# EAGLE design door-lock-pcb (EAGLE 9.6.2)
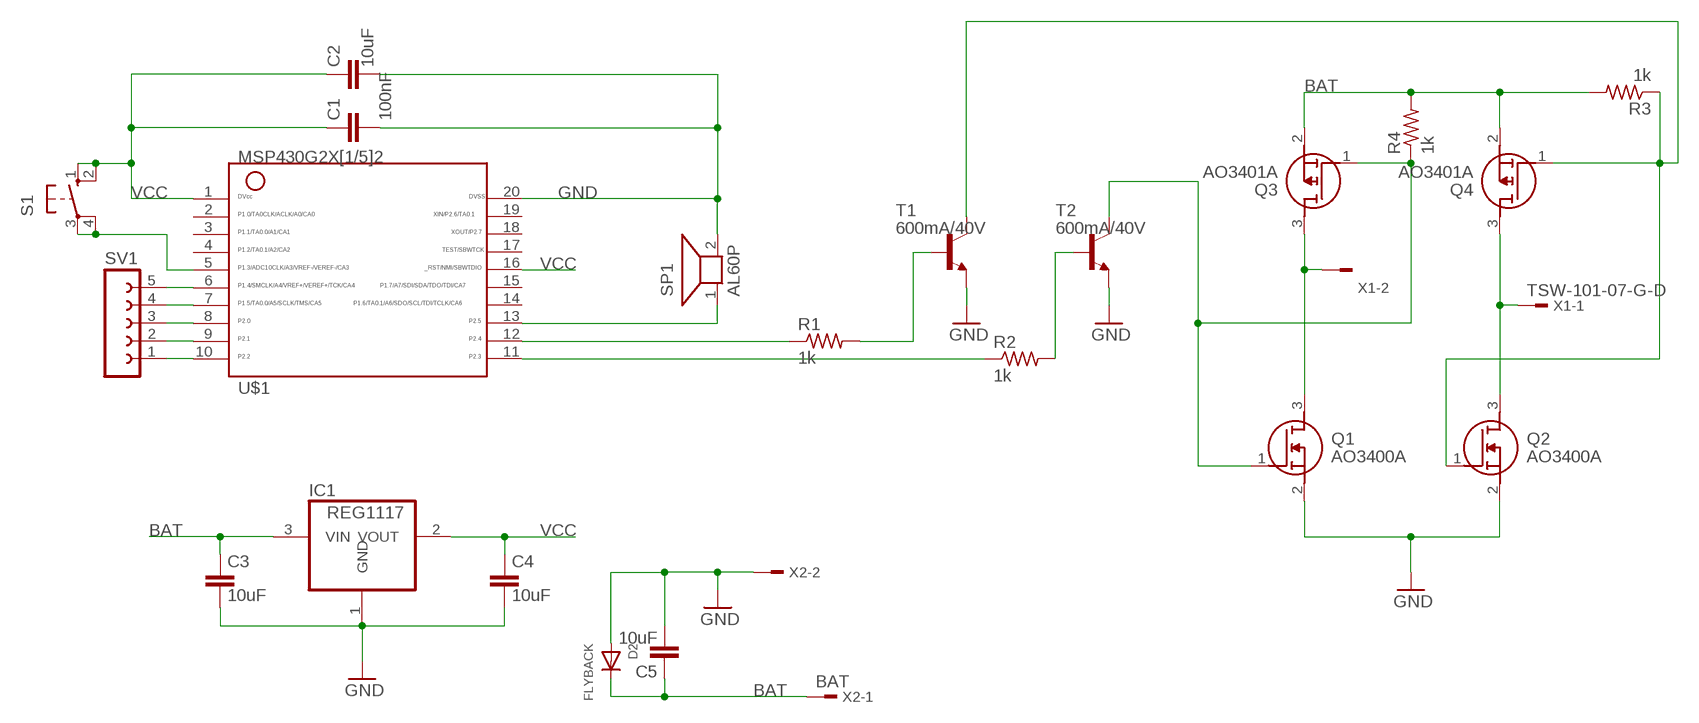
[diagram p0: schematic, sheet 1]

## Parts
C1  100nF  CC0805KRX7R9BB104  [CAP_0805]
C2  10uF  CC0805KRX7R9BB104  [CAP_0805]
C3  10uF  CC0805KRX7R9BB104  [CAP_0805]
C4  10uF  CC0805KRX7R9BB104  [CAP_0805]
C5  10uF  CC0805KRX7R9BB104  [CAP_0805]
D2  FLYBACK  DIODESOD-523  [SOD-523]
IC1  REG1117  [SOT223]
Q1  AO3400A  [SOT95P280X125-3N]
Q2  AO3400A  [SOT95P280X125-3N]
Q3  AO3401A  [SOT95P280X125-3N]
Q4  AO3401A  [SOT95P280X125-3N]
R1  1k  CRCW08050000Z0EA  [RES_0805]
R2  1k  CRCW08050000Z0EA  [RES_0805]
R3  1k  CRCW08050000Z0EA  [RES_0805]
R4  1k  CRCW08050000Z0EA  [RES_0805]
S1  10-XX  [B3F-10XX]
SP1  AL60P  [AL60P]
SV1  FE05-1  [FE05-1]
T1  600mA/40V  TRANS_NPN-MMBT2222AL  [SOT23-3]
T2  600mA/40V  TRANS_NPN-MMBT2222AL  [SOT23-3]
U$1  G2X[1/5]2---N20  [N20]
X1  TSW-101-07-G-D  [TSW-101-XX-G-D]
X2  BAT  TSW-101-07-G-D  [TSW-101-XX-G-D]

## Nets
BAT: C3.1 C5.1 D2.K(C) IC1.3(VIN) Q3.2(S) Q4.2(S) R3.2 R4.2 X2.1
GND: C1.2 C2.2 C3.2 C4.2 C5.2 D2.A IC1.1(GND) Q1.2(S) Q2.2(S) SP1.2 T1.2(E) T2.2(E) U$1.20 X2.2
N$1: SV1.1 U$1.10
N$2: SV1.2 U$1.9
N$3: SV1.3 U$1.8
N$4: SV1.4 U$1.7
N$5: SV1.5 U$1.6
N$6: SP1.1 U$1.13
N$8: S1.3(P) S1.4(P1) U$1.5
N$9: Q1.1(G) Q3.1(G) R4.1 T2.3(C)
N$10: Q2.1(G) Q4.1(G) R3.1 T1.3(C)
N$11: R1.1 U$1.12
N$12: R1.2 T1.1(B)
N$13: R2.2 T2.1(B)
N$14: R2.1 U$1.11
N$18: Q1.3(D) Q3.3(D) X1.2
N$19: Q2.3(D) Q4.3(D) X1.1
VCC: C1.1 C2.1 C4.1 IC1.2(VOUT) S1.1(S) S1.2(S1) U$1.1 U$1.16
Unconnected: U$1.2 U$1.3 U$1.4 U$1.14 U$1.15 U$1.17 U$1.18 U$1.19

## Library data of the parts
C1-C5 = Resistor_Capacitor:CC0805KRX7R9BB104: CAP CER 0.1UF 50V X7R 0805 Manufacturer's datasheet <http://www.yageo.com/documents/recent/UPY-GPHC_X7R_6.3V-to-50V_18.pdf>; CREATED_BY: PCBLayout.com; DIGIKEY_PART_NUMBER: 311-1140-2-ND; MANUFACTURER: Yageo; MPN: CC0805KRX7R9BB104; PACKAGE: SMD 0805
D2 = adafruit:DIODE: Diode SMADIODE - SMA Surface Mount Package 20V 1A Schottky Diode Digikey: 641-1014-6-ND DO-1N4148 - Through Hole Small Current Diode SOD-123 20V 1 A (.5mV Vf) Schottky Diode - Digikey: MBRX120TPMSCT-ND SOD-323 10V 570mA (.38mV Vf, 3ns) Schottky Diode - Digikey: ZLLS410CT-ND SOD-523 30V 30mA Schottky Diode (RB751S-40TE61) - Digikey: RB751S-40TE61CT-ND SOT23-R/W - SOT23 Package (R = Solder Paste/Reflow Ovens, W = Hand-Soldering) BAT54Film 40V 300mA - Digikey: 497-7162-1-ND
IC1 = burr-brown:REG1117: 800mA and 1A Low Dropout (LDO) Positive Regulator 1.8V, 2.5V, 2.85V, 3.3V, 5V, and Adj; MPN: REG1117; OC_FARNELL: 1097566; OC_NEWARK: 14P6981
Q1 Q2 = AO3400A:AO3400A: 30V N-Channel MOSFET Source: Datasheet <http://aosmd.com/res/data_sheets/AO3400A.pdf>; ARROW_PART_NUMBER: AO3400A; ARROW_PRICE-STOCK: https://www.arrow.com/en/products/ao3400a/alpha-and-omega-semiconductor?region=nac; DESCRIPTION: 30V N-Channel MOSFET; HEIGHT: 1.25mm; MANUFACTURER_NAME: Alpha & Omega Semiconductors; MANUFACTURER_PART_NUMBER: AO3400A
Q3 Q4 = AO3401A:AO3401A: 30V P-Channel MOSFET Source: Datasheet <http://www.aosmd.com/pdfs/datasheet/AO3401A.pdf>; ARROW_PART_NUMBER: AO3401A; ARROW_PRICE-STOCK: https://www.arrow.com/en/products/ao3401a/alpha-and-omega-semiconductor?region=nac; DESCRIPTION: 30V P-Channel MOSFET; HEIGHT: 1.25mm; MANUFACTURER_NAME: Alpha & Omega Semiconductors; MANUFACTURER_PART_NUMBER: AO3401A
R1-R4 = Resistor_Capacitor:CRCW08050000Z0EA: RES SMD 0 OHM JUMPER 1/8W 0805 Manufacturer's datasheet <http://www.vishay.com/docs/20035/dcrcwe3.pdf>; CREATED_BY: PCBLayout.com; DIGIKEY_PART_NUMBER: 541-0.0ATR-ND; MANUFACTURER: Vishay Dale; MPN: CRCW08050000Z0EA; PACKAGE: SMD 0805
S1 = switch-omron:10-XX: OMRON SWITCH; MPN: B3F-1000; OC_FARNELL: 176432; OC_NEWARK: 36M3542
SP1 = buzzer:AL60P: SPEAKER Source: Buerklin; OC_FARNELL: unknown; OC_NEWARK: unknown
SV1 = con-lsta:FE05-1: FEMALE HEADER; OC_FARNELL: unknown; OC_NEWARK: unknown
T1 T2 = SparkFun-DiscreteSemi:TRANS_NPN: NPN transistor Current controlled devices typically used to amplify current or used as a switch. BC547 - COM-08928 <http://www.sparkfun.com/products/8928> (TO-92 45V 100mA) (1.Collector 2.Base 3.Emitter) 2N3904 - COM-00521 <http://www.sparkfun.com/products/521> (TO-92 40V 200mA) (1.Emitter 2.Base 3.Collector) P2N2222A - COM-12852 <http://www.sparkfun.com/products/12852> (TO-92 40V 600mA) (1.Collector 2.Base 3.Emitter); PROD_ID: TRANS-08049
U$1 = TI_MSP430_v16:G2X[1/5]2---N20: MSP430G2X[1/5]2 MSP430G2x52, MSP430G2x12 PDIP (N) 20 Pin Package http://focus.ti.com/docs/prod/folders/print/msp430g2452.html
X1 X2 = con-samtec:TSW-101-*-G: THROUGH-HOLE .025" SQ POST HEADER Source: Samtec TSW.pdf; MF: Samtec Inc.; MPN: TSW-101-07-G-D

## Board
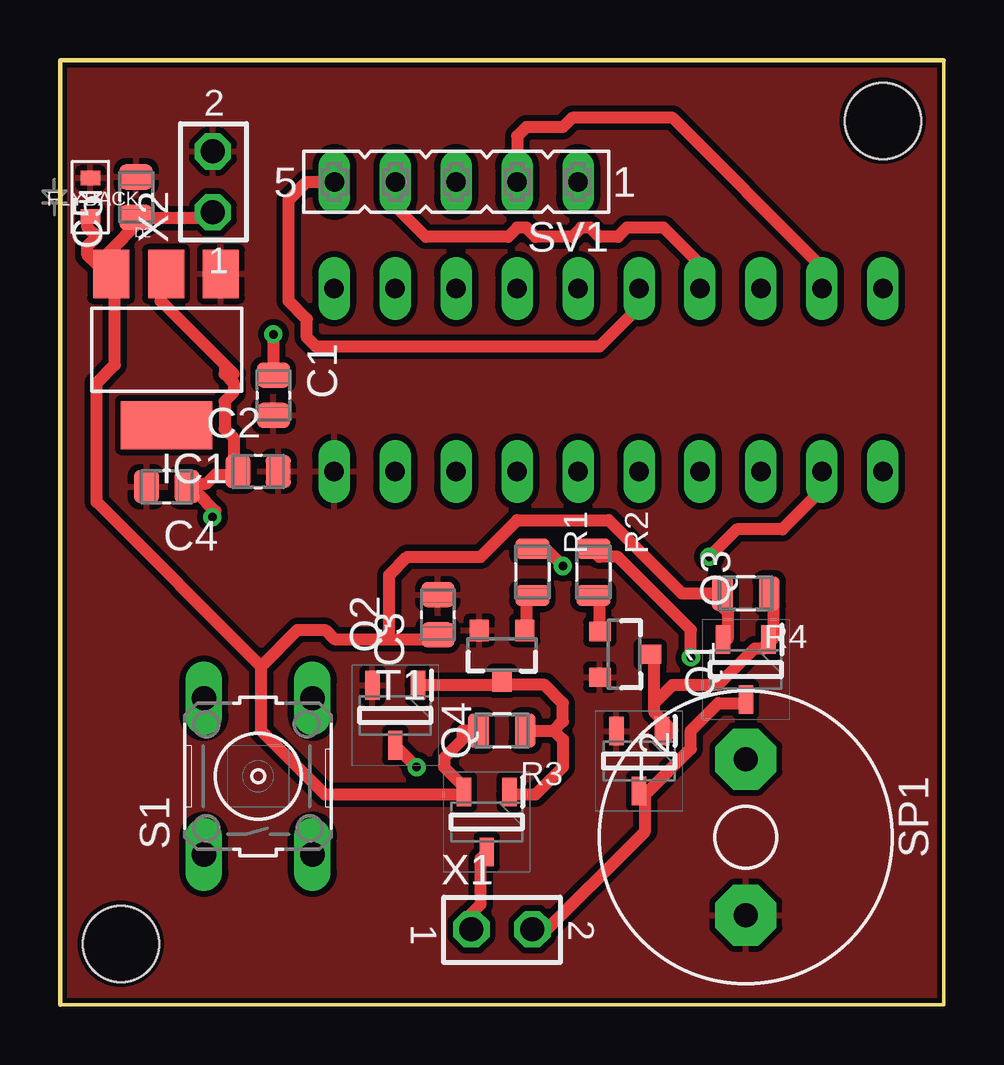
[diagram p1: board, top side]
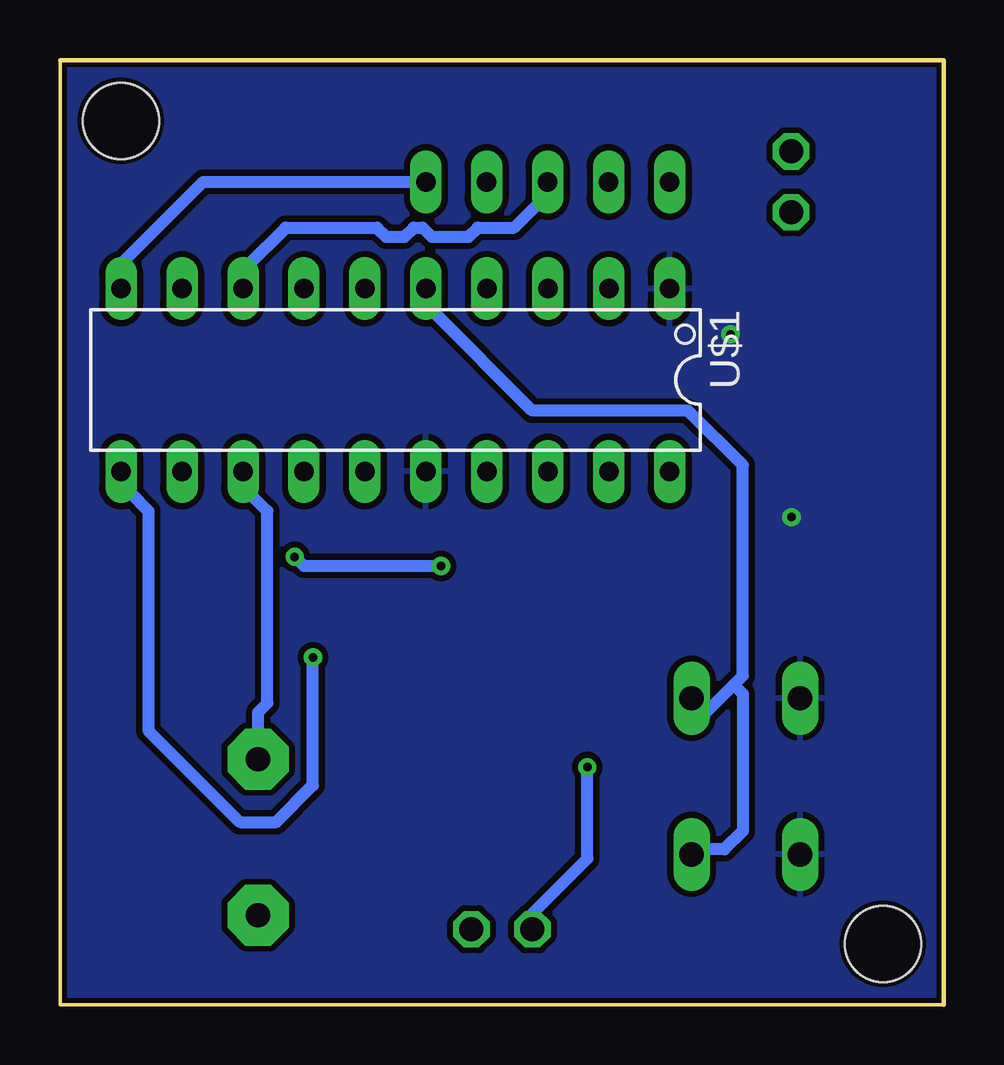
[diagram p2: board, bottom side, seen from below]

Size 36.83 x 39.37 mm. Coordinates in mm from the lower left corner, seen from the top.
Outline: 36.83,39.37 36.83,0 0,0 0,39.37 36.83,39.37
Copper layers (1*16): Top 0.035mm / dielectric 1.5mm / Bottom 0.035mm
Design rules "default *": minimum track width 20mil, minimum drill 0.35mm, track to track 10mil, track to pad 10mil, pad to pad 10mil, via to via 10mil, smd to smd 8mil, copper to edge 8mil, drill to drill 8mil, minimum pad ring 10mil, minimum via ring 8mil, stop-mask expansion 4mil, vias tented up to drill 0mil, thermal gap 10mil
Holes 3.17 mm at 2.54,2.54 34.29,36.83

### Footprints (pad centres in the part's own frame; a part is rotated, then mirrored left to right if it is on the bottom)
CAP_0805 = smd 1.05 x 1.38: 1 -0.84,0; 2 0.84,0
SOD-523 = smd 0.8 x 0.6: A 0,-0.8; K 0,0.8
SOT223 = smd 1.499 x 2.007: 1 -2.261,-3.15; 2 0.025,-3.15; 3 2.311,-3.15 | smd 3.81 x 2.007: 4 0,3.15
SOT95P280X125-3N = smd 1.2 x 0.6: 1 -1.25,0.95; 2 -1.25,-0.95; 3 1.25,0
RES_0805 = smd 0.87 x 1.42: 1 -0.975,0; 2 0.975,0
B3F-10XX = drill 1.016 long: 1 -3.251,2.261; 2 3.251,2.261; 3 -3.251,-2.261; 4 3.251,-2.261
AL60P = drill 1.016 pad 2.54 octagon: 1 -3.251,0; 2 3.251,0
FE05-1 = drill 0.813 long: 1 -5.08,0; 2 -2.54,0; 3 0,0; 4 2.54,0; 5 5.08,0
SOT23-3 = smd 0.8 x 0.9: 1 -0.95,-1; 2 0.95,-1; 3 0,1.1
N20 = drill 0.813 long: 1 -11.435,-3.81; 2 -8.895,-3.81; 3 -6.355,-3.81; 4 -3.815,-3.81; 5 -1.275,-3.81; 6 1.265,-3.81; 7 3.805,-3.81; 8 6.345,-3.81; 9 8.885,-3.81; 10 11.425,-3.81; 11 11.425,3.81; 12 8.885,3.81; 13 6.345,3.81; 14 3.805,3.81; 15 1.265,3.81; 16 -1.275,3.81; 17 -3.815,3.81; 18 -6.355,3.81; 19 -8.895,3.81; 20 -11.435,3.81
TSW-101-XX-G-D = drill 1 pad 1.5 octagon: 1 0.02,-1.27; 2 0.02,1.27

### Placement (x,y rotation side)
C1  8.89,25.4 270 top
C2  8.26,22.23 0 top
C3  15.75,16.26 90 top
C4  4.45,21.59 180 top
C5  3.17,33.66 90 top
D2  1.27,33.66 180 top
IC1  4.45,27.3 180 top
Q1  24.13,10.16 270 top
Q2  13.97,12.06 270 top
Q3  28.57,13.97 270 top
Q4  17.78,7.62 270 top
R1  19.68,18.03 270 top
R2  22.23,18.03 270 top
R3  18.41,11.43 180 top
R4  28.57,17.14 180 top
S1  8.26,9.53 90 top
SP1  28.57,6.99 270 top
SV1  16.51,34.29 180 top
T1  18.41,14.61 180 top
T2  23.5,14.61 270 top
U$1  22.86,26.04 180 bottom
X1  18.41,3.17 270 top
X2  6.35,34.29 0 top

### Tracks (layer width: path | path; a pad name or v marks a point on that pad's centre or on a via)
BAT
  Top 0.508: 1.91,30.86 1.52,30.86 1.14,31.24 1.14,31.62 1.52,32 1.14,32.38 1.14,32.77 D2.K | 1.91,30.86 2.29,30.48 IC1.3 | 3.43,32.77 6.1,32.77 X2.1 | 1.91,30.86 1.91,31.24 3.43,32.77 | 1.91,30.86 IC1.3 | 3.43,32.77 C5.1 | 27.43,17.14 27.43,16.76 27.81,16.38 27.81,15.24 Q3.2 | R3.2 16.76,11.43 16.76,11.05 16,10.29 16,9.91 16.76,9.14 Q4.2 16.76,8.76 11.05,8.76 8.38,11.43 8.38,14.1 | 13.72,15.24 11.43,15.24 11.05,15.62 9.91,15.62 8.38,14.1 | 13.72,15.24 15.62,15.24 C3.1 | 27.43,17.14 25.91,17.14 22.86,20.19 19.05,20.19 17.53,18.67 14.48,18.67 13.72,17.91 13.72,15.24 | 27.43,17.14 R4.2 | 8.38,14.1 1.52,20.95 1.52,25.91 2.29,26.67 2.29,30.1 IC1.3
GND
  pour Top: 0,0 36.83,0 36.83,39.37 0,39.37
N$1
  Bottom 0.508: SV1.1 30.86,34.29 34.29,30.86 34.29,30.1 U$1.10
N$2
  Top 0.508: SV1.2 19.05,36.2 19.43,36.58 20.95,36.58 21.34,36.96 25.53,36.96 31.62,30.86 31.62,30.1 U$1.9
N$3
  Bottom 0.508: SV1.3 16.76,34.29 16.76,33.53 17.91,32.38 19.43,32.38 19.81,32 21.34,32 21.72,32.38 22.1,32.38 22.48,32 23.24,32 23.62,32.38 27.43,32.38 28.96,30.86 28.96,30.1 U$1.8
N$4
  Top 0.508: SV1.4 14.1,34.29 14.1,33.15 15.24,32 18.67,32 19.05,32.38 19.43,32.38 19.81,32 21.34,32 21.72,32.38 22.1,32.38 22.48,32 23.24,32 23.62,32.38 25.15,32.38 26.67,30.86 26.67,30.1 U$1.7
N$5
  Top 0.508: SV1.5 10.29,34.29 9.53,33.53 9.53,29.34 10.29,28.57 10.29,27.81 10.67,27.43 22.48,27.43 24,28.96 24,29.72 U$1.6
N$6
  Bottom 0.508: SP1.1 28.57,12.19 28.19,12.57 28.19,20.57 28.96,21.34 28.96,22.1 U$1.13
N$8
  Bottom 0.508: 8.76,13.34 9.91,12.19 10.29,12.19 10.67,12.57 S1.4 | 8.76,13.34 8.38,13.72 8.38,22.48 10.67,24.77 17.14,24.77 21.34,28.96 21.34,29.72 U$1.5 | 8.76,13.34 8.38,12.95 8.38,7.24 9.14,6.48 10.29,6.48 S1.3
N$9
  Top 0.508: R4.1 29.72,17.14 29.72,15.24 Q3.1 29.34,14.86 28.96,14.86 27.43,13.34 25.53,13.34 24.77,12.57 | 24.77,12.57 24.77,12.19 25.53,11.43 25.15,11.05 Q1.1 | 24.77,12.57 24.77,14.48 T2.3
N$10
  Top 0.508: Q2.1 14.86,13.34 18.29,13.34 T1.3 18.67,13.34 20.19,13.34 20.95,12.57 20.95,11.81 20.57,11.43 | 20.57,11.43 20.95,11.05 20.95,9.91 19.81,8.76 18.67,8.76 Q4.1 | R3.1 20.57,11.43
N$11  (via drill 0.35)
  Top 0.508: v20.95,18.29 20.19,19.05 19.81,19.05 R1.1 | v27.05,18.67 28.19,19.81 30.1,19.81 31.62,21.34 31.62,22.1 U$1.12
  Bottom 0.508: v20.95,18.29 26.67,18.29 v27.05,18.67
N$12
  Top 0.508: T1.1 19.43,15.62 19.43,16.76 R1.2
N$13
  Top 0.508: T2.1 22.48,15.62 22.48,16.76 R2.2
N$14  (via drill 0.35)
  Top 0.508: v26.29,14.48 26.29,15.62 23.24,18.67 22.48,18.67 R2.1
  Bottom 0.508: v26.29,14.48 26.29,9.14 27.81,7.62 29.34,7.62 33.15,11.43 33.15,20.57 33.91,21.34 33.91,22.1 U$1.11
N$18
  Top 0.508: 24.38,8.76 24.38,7.24 19.81,2.67 19.43,3.05 X1.2 | 24.38,8.76 26.29,10.67 26.29,11.43 27.43,12.57 28.57,12.57 Q3.3 | 24.38,8.76 Q1.3
N$19  (via drill 0.35)
  Top 0.508: v14.86,9.91 14.1,10.67 Q2.3 | Q4.3 17.53,6.1 17.53,4.19 16.76,3.43 17.14,3.05 X1.1
  Bottom 0.508: v14.86,9.91 14.86,6.1 17.53,3.43 17.14,3.05 X1.1
VCC  (via drill 0.35)
  Top 0.508: v6.35,20.32 6.48,20.57 5.71,21.34 5.33,21.34 C4.1 5.33,21.72 6.1,21.72 6.48,22.1 7.24,22.1 C2.1 7.24,22.48 7.24,23.62 6.86,24 6.86,25.15 7.24,25.53 7.24,25.91 6.86,26.29 6.86,26.67 | 6.86,26.67 4.19,29.34 4.19,30.1 IC1.2 | 6.86,26.67 7.24,26.29 | C1.1 8.76,26.29 8.89,26.42 v8.89,27.94
  pour Bottom: 0,0 36.83,0 36.83,39.37 0,39.37